# EAGLE schematic ttab (EAGLE 6.3)
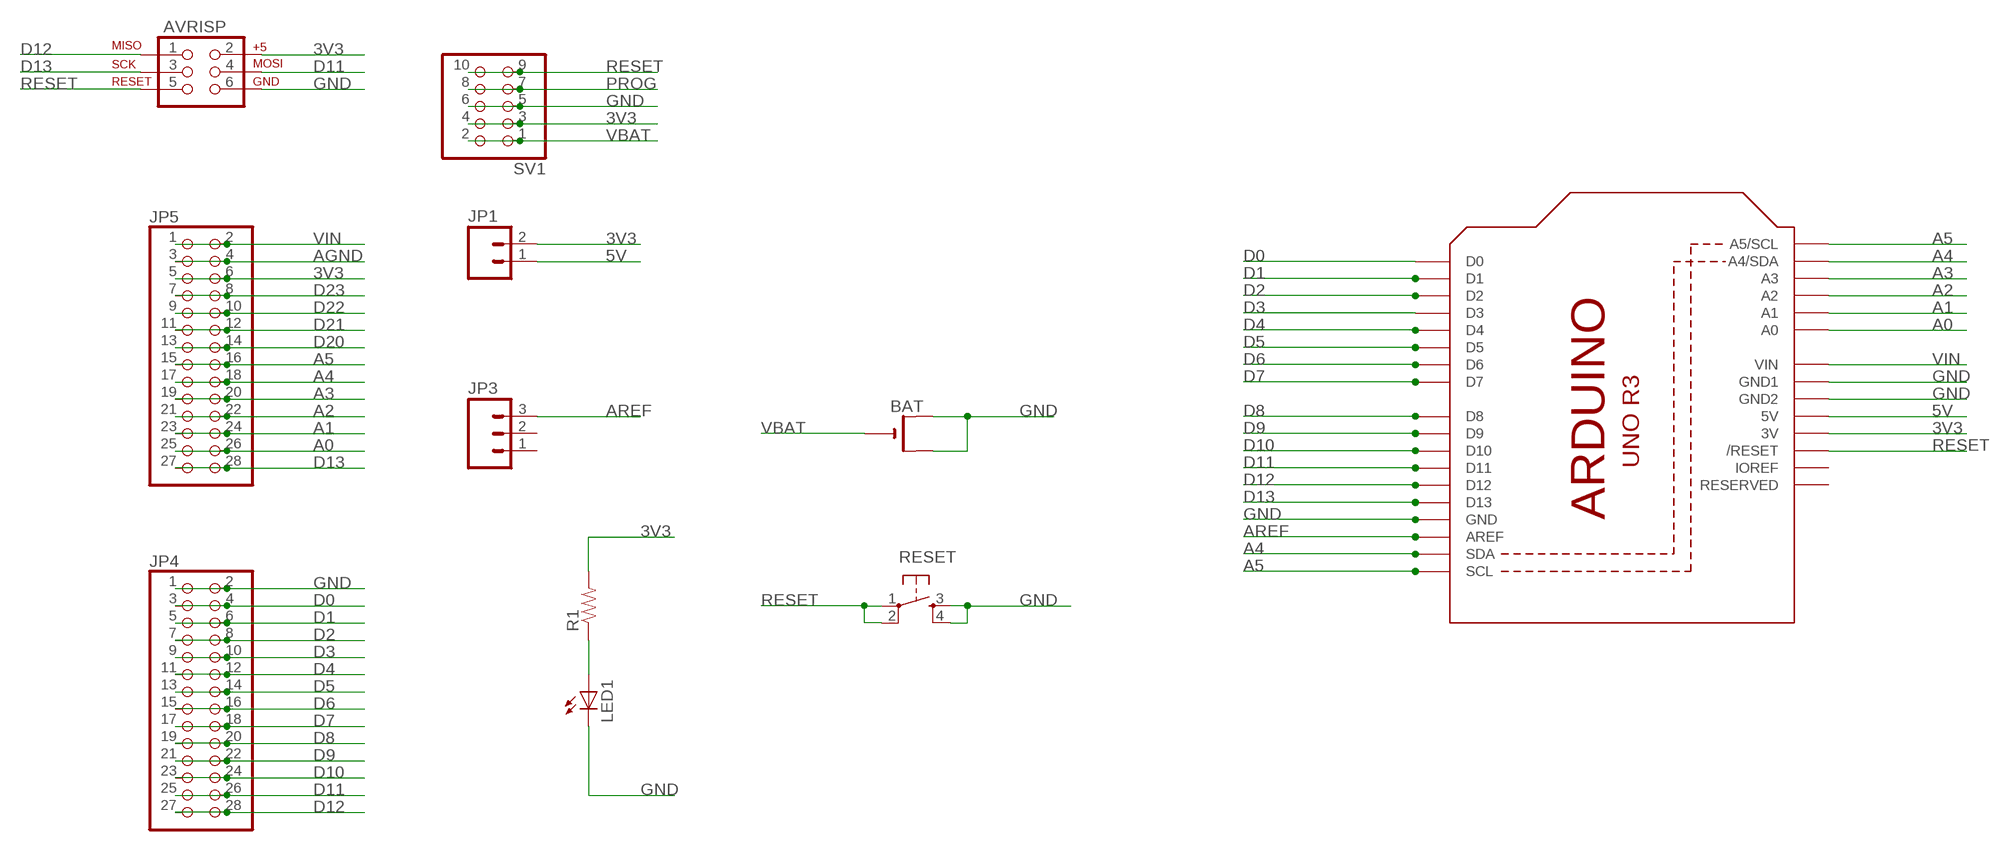
[diagram p0: schematic, sheet 1]

## Parts
AVRISP  AVR_SPI_PRG_6PTH  [2X3]
BAT  CR1220THM  [CR1220-THM]
JP1  M02LOCK  [1X02_LOCK]
JP3  M03PTH  [1X03]
JP4  PINHD-2X14  [2X14]
JP5  PINHD-2X14  [2X14]
LED1  LEDCHIP-LED0805  [CHIP-LED0805]
R1  RESISTOR0805-RES  [0805]
RESET  TAC_SWITCHPTH  [TACTILE-PTH]
SV1  PINHD-2X5  [2X05]
U4  ARDUINOR3-DIMENSION  [ARDUINOR3]

## Nets
3V3: AVRISP.2 JP1.2 JP5.5 JP5.6 R1.2 SV1.3 SV1.4 U4.3V
5V: JP1.1 U4.5V
A0: JP5.25 JP5.26 U4.A0
A1: JP5.23 JP5.24 U4.A1
A2: JP5.21 JP5.22 U4.A2
A3: JP5.19 JP5.20 U4.A3
A4: JP5.17 JP5.18 U4.A4(A4/SDA) U4.SDA
A5: JP5.15 JP5.16 U4.A5(A5/SCL) U4.SCL
AGND: JP5.3 JP5.4
AREF: JP3.3 U4.AREF
D0: JP4.3 JP4.4 U4.D0
D1: JP4.5 JP4.6 U4.D1
D2: JP4.7 JP4.8 U4.D2
D3: JP4.9 JP4.10 U4.D3
D4: JP4.11 JP4.12 U4.D4
D5: JP4.13 JP4.14 U4.D5
D6: JP4.15 JP4.16 U4.D6
D7: JP4.17 JP4.18 U4.D7
D8: JP4.19 JP4.20 U4.D8
D9: JP4.21 JP4.22 U4.D9
D10: JP4.23 JP4.24 U4.D10
D11: AVRISP.4 JP4.25 JP4.26 U4.D11
D12: AVRISP.1 JP4.27 JP4.28 U4.D12
D13: AVRISP.3 JP5.27 JP5.28 U4.D13
D20: JP5.13 JP5.14
D21: JP5.11 JP5.12
D22: JP5.9 JP5.10
D23: JP5.7 JP5.8
GND: AVRISP.6 BAT.+1(+) BAT.+2(+1) JP4.1 JP4.2 LED1.C RESET.3 RESET.4 SV1.5 SV1.6 U4.GND U4.GND1 U4.GND2
N$1: LED1.A R1.1
PROG: SV1.7 SV1.8
RESET: AVRISP.5 RESET.1 RESET.2 SV1.9 SV1.10 U4.RESET(/RESET)
VBAT: BAT.- SV1.1 SV1.2
VIN: JP5.1 JP5.2 U4.VIN
Unconnected: JP3.1 JP3.2 U4.IOREF U4.RESERVED

## Library data of the parts
AVRISP = SparkFun-Connectors:AVR_SPI_PRG_6: AVR ISP 6 Pin This is the reduced ISP connector for AVR programming. Common on Arduino. This footprint will take up less PCB space and can be used with a 10-pin to 6-pin adapter such as SKU: BOB-08508
BAT = adafruit:CR1220: CR1216/CR1220/CR1225 12mm 3V lithium coin cell Great for battery packup. Both SMT and THM holders. Note the THM package has the ground pads on both sides of the PCB so that the masks are the same - this reduces the cost
JP1 = SparkFun-Connectors:M02: Header 2 Standard 2-pin 0.1" header. Use with straight break away headers (SKU : PRT-00116), right angle break away headers (PRT-00553), swiss pins (PRT-00743), machine pins (PRT-00117), and female headers (PRT-00115). Molex polarized connector foot print use with SKU : PRT-08233 with associated crimp pins and housings.
JP3 = SparkFun-Connectors:M03: Header 3 Standard 3-pin 0.1" header. Use with straight break away headers (SKU : PRT-00116), right angle break away headers (PRT-00553), swiss pins (PRT-00743), machine pins (PRT-00117), and female headers (PRT-00115). Molex polarized connector foot print use with SKU : PRT-08232 with associated crimp pins and housings.
JP4 JP5 = adafruit:PINHD-2X14: PIN HEADER
LED1 = adafruit:LED: LED OSRAM: - CHIPLED LG R971, LG N971, LY N971, LG Q971, LY Q971, LO R971, LY R971 LH N974, LH R974 LS Q976, LO Q976, LY Q976 LO Q996 - Hyper CHIPLED LW Q18S LB Q993, LB Q99A, LB R99A - SideLED LS A670, LO A670, LY A670, LG A670, LP A670 LB A673, LV A673, LT A673, LW A673 LH A674 LY A675 LS A676, LA A676, LO A676, LY A676, LW A676 LS A679, LY A679, LG A679 - Hyper Micro SIDELED® LS Y876, LA Y876, LO Y876, LY Y876 LT Y87S - SmartLED LW L88C, LW L88S LB L89C, LB L89S, LG L890 LS L89K, LO L89K, LY L89K LS L896, LA L896, LO L896, LY L896 - TOPLED LS T670, LO T670, LY T670, LG T670, LP T670 LSG T670, LSP T670, LSY T670, LOP T670, LYG T670 LG T671, LOG T671, LSG T671 LB T673, LV T673, LT T673, LW T673 LH T674 LS T676, LA T676, LO T676, LY T676, LB T676, LH T676, LSB T676, LW T676 LB T67C, LV T67C, LT T67C, LS T67K, LO T67K, LY T67K, LW E67C LS E67B, LA E67B, LO E67B, LY E67B, LB E67C, LV E67C, LT E67C LW T67C LS T679, LY T679, LG T679 LS T770, LO T770, LY T770, LG T770, LP T770 LB T773, LV T773, LT T773, LW T773 LH T774 LS E675, LA E675, LY E675, LS T675 LS T776, LA T776, LO T776, LY T776, LB T776 LHGB T686 LT T68C, LB T68C - Hyper Mini TOPLED® LB M676 - Mini TOPLED Santana® LG M470 LS M47K, LO M47K, LY M47K Source: http://www.osram.convergy.de/
R1 = SparkFun-Passives:RESISTOR: Resistor Basic schematic elements and footprints for 0603, 1206, and PTH resistors.
RESET = SparkFun-Electromechanical:TAC_SWITCH: Momentary Switch Button commonly used for reset or general input. Spark Fun Electronics SKU : COM-00097
SV1 = pinhead:PINHD-2X5: PIN HEADER
U4 = thewknd:ARDUINOR3: This is a new object for the new Arduino R3 - with extra pins that you may want to use (such as IOref, and duplicated A4/A5